# Altium schematic sheet PWM_CONTROL.SchDoc: PWM Control
size 279 x 215 mm; DrawnBy: Ethan Abraham; Engineer: Ethan Abraham; Revision: 1.0; SheetNumber: 7; SheetTotal: 7
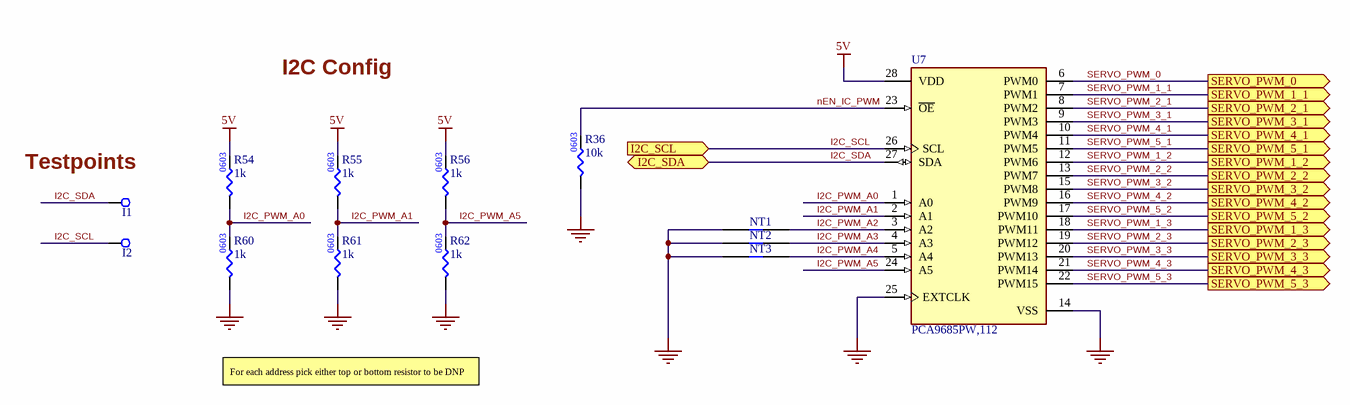
[diagram p0: PWM_CONTROL.SchDoc]

## Parts
I1  RCWCTE  [RCWCTE]  (value not drawn)
I2  RCWCTE  [RCWCTE]  (value not drawn)
NT1  .NET_TIE  [.NET_TIE]  (value not drawn)
NT2  .NET_TIE  [.NET_TIE]  (value not drawn)
NT3  .NET_TIE  [.NET_TIE]  (value not drawn)
R36  Resistance: 10k  [.RES_0603]  (hidden comment: RC0603FR-0710KL)
R54  Resistance: 1k  [.RES_0603]  (hidden comment: RC0603FR-071KL)
R55  Resistance: 1k  [.RES_0603]  (hidden comment: RC0603FR-071KL)
R56  Resistance: 1k  [.RES_0603]  (hidden comment: RC0603FR-071KL)
R60  Resistance: 1k  [.RES_0603]  (hidden comment: RC0603FR-071KL)
R61  Resistance: 1k  [.RES_0603]  (hidden comment: RC0603FR-071KL)
R62  Resistance: 1k  [.RES_0603]  (hidden comment: RC0603FR-071KL)
U7  PCA9685PW,112  [PCA9685PW,112]

## Ports
I2C_SCL (in), I2C_SDA (bidir), SERVO_PWM_0 (out), SERVO_PWM_1_1 (out), SERVO_PWM_1_2 (out), SERVO_PWM_1_3 (out), SERVO_PWM_2_1 (out), SERVO_PWM_2_2 (out), SERVO_PWM_2_3 (out), SERVO_PWM_3_1 (out), SERVO_PWM_3_2 (out), SERVO_PWM_3_3 (out), SERVO_PWM_4_1 (out), SERVO_PWM_4_2 (out), SERVO_PWM_4_3 (out), SERVO_PWM_5_1 (out), SERVO_PWM_5_2 (out), SERVO_PWM_5_3 (out)

## Nets
5V: R54.2 R55.2 R56.2 U7.28(VDD)
GND: NT1.1 NT2.1 NT3.1 R36.1 R60.1 R61.1 R62.1 U7.14(VSS) U7.25(EXTCLK)
I2C_PWM_A0: R54.1 R60.2 U7.1(A0)
I2C_PWM_A1: R55.1 R61.2 U7.2(A1)
I2C_PWM_A2: NT1.2 U7.3(A2)
I2C_PWM_A3: NT2.2 U7.4(A3)
I2C_PWM_A4: NT3.2 U7.5(A4)
I2C_PWM_A5: R56.1 R62.2 U7.24(A5)
I2C_SCL: I2.1 U7.26(SCL) ; port I2C_SCL
I2C_SDA: I1.1 U7.27(SDA) ; port I2C_SDA
nEN_IC_PWM: R36.2 U7.23(~{OE})
SERVO_PWM_0: U7.6(PWM0) ; port SERVO_PWM_0
SERVO_PWM_1_1: U7.7(PWM1) ; port SERVO_PWM_1_1
SERVO_PWM_1_2: U7.12(PWM6) ; port SERVO_PWM_1_2
SERVO_PWM_1_3: U7.18(PWM11) ; port SERVO_PWM_1_3
SERVO_PWM_2_1: U7.8(PWM2) ; port SERVO_PWM_2_1
SERVO_PWM_2_2: U7.13(PWM7) ; port SERVO_PWM_2_2
SERVO_PWM_2_3: U7.19(PWM12) ; port SERVO_PWM_2_3
SERVO_PWM_3_1: U7.9(PWM3) ; port SERVO_PWM_3_1
SERVO_PWM_3_2: U7.15(PWM8) ; port SERVO_PWM_3_2
SERVO_PWM_3_3: U7.20(PWM13) ; port SERVO_PWM_3_3
SERVO_PWM_4_1: U7.10(PWM4) ; port SERVO_PWM_4_1
SERVO_PWM_4_2: U7.16(PWM9) ; port SERVO_PWM_4_2
SERVO_PWM_4_3: U7.21(PWM14) ; port SERVO_PWM_4_3
SERVO_PWM_5_1: U7.11(PWM5) ; port SERVO_PWM_5_1
SERVO_PWM_5_2: U7.17(PWM10) ; port SERVO_PWM_5_2
SERVO_PWM_5_3: U7.22(PWM15) ; port SERVO_PWM_5_3

## Notes on the sheet
- I2C Config
- (near I1) Testpoints
- For each address pick either top or bottom resistor to be DNP
- PuttPilot
- 200 University Ave W
- PROJECT
- Waterloo, Ontario, Canada
- N2L 3G1
- REVISION
- DOCUMENT
- ENGINEER
- REVIEWER
- MODIFIED
- SHEET
- OF

## Library data of the parts
I1 I2 = RCWCTE: SMT Test Point; Manufacturer: KOA Speer; Resistance: 0R; Current Rating: 2A; Number of Contacts: 1; Supplier 1: Digikey; Manufacturer Part Number: RCWCTE; RoHS: Yes; Category: Chip SMD Resistors; Stock 1: 56953; Pricing 1: 1=0.2, 10=0.15, 25=0.1344, 50=0.1238, 100=0.1141, 250=0.10268, 500=0.09488, 1000=0.08781 (USD); Mount: Surface Mount; Case/Package: 1206; Case Code (Imperial): 1206; Case Code (Metric): 3216; Contact Material: Copper,Tin; Min Operating Temperature: -55°C; Max Operating Temperature: 125°C; Packaging: Tape and Reel; Termination: SMD/SMT; Series: RC; Length: 3.2mm; Width: 1.6mm; Height: 2mm; Depth: 1.6mm; Military Standard: Not; RoHS Compliant: Yes; ComponentLink1URL: https://datasheet.ciiva.com/34302/1876186-34302940.pdf?src-supplier=Jameco; ComponentLink1Description: https://datasheet.ciiva.com/34302/1876186-34302940.pdf?src-supplier=Jameco; ComponentLink2URL: https://datasheet.ciiva.com/5556/rc-5556236.pdf?src-supplier=Mouser; ComponentLink2Description: https://datasheet.ciiva.com/5556/rc-5556236.pdf?src-supplier=Mouser; ComponentLink3URL: https://datasheet.ciiva.com/26821/getdatasheetpartid-110197-26821157.pdf?src-supplier=Verical; ComponentLink3Description: https://datasheet.ciiva.com/26821/getdatasheetpartid-110197-26821157.pdf?src-supplier=Verical; Supplier Part Number 1: 2019-RCWCTECT-ND
NT1-NT3 = .NET_TIE: .GENERIC NET TIE
R36 = RC0603FR-0710KL: RES 10K OHM 0603; Manufacturer: Yageo; Tolerance: 1%; Additional Feature: LASER TRIMMABLE; Rated Power Dissipation (P): 100mW; Rated Temperature: 70°C; Temperature Coefficient: 100ppm/°C; Working Voltage: 75V; Package Height: 0.45mm; Package Length: 1.6mm; Package Width: 0.8mm; Supplier 1: Future Electronics; Manufacturer Part Number: RC0603FR-0710KL; RoHS: Yes; Category: Chip SMD Resistors; Stock 1: 30355000; Pricing 1: 5000=0.0026, 50000=0.0025, 150000=0.0024, 375000=0.0023, 1000000=0.0022 (USD); Mount: Surface Mount; Number of Pins: 2; Package Shape: Rectangular; Size Code: 0603; Terminal Finish: Nickel; Min Operating Temperature: -55°C; Max Operating Temperature: 155°C; JESD-609 Code: e3; Resistor Type: FIXED RESISTOR; Construction: Chip; Package Style: SMTMeter; Packaging: Tape and Reel; Technology: METAL GLAZE/THICK FILM; Termination: Wraparound; Reach SVHC Compliant: Yes; RoHS Compliant: Yes; ComponentLink1URL: https://datasheet.ciiva.com:443/pdfs/VipMasterIC/IC/YAGO/YAGO-S-A0008145938/YAGO-S-A0008145938-1.pdf?src-supplier=IHS+Markit; ComponentLink1Description: https://datasheet.ciiva.com:443/pdfs/VipMasterIC/IC/YAGO/YAGO-S-A0008145938/YAGO-S-A0008145938-1.pdf?src-supplier=IHS+Markit; ComponentLink2URL: https://datasheet.ciiva.com/22747/443971-22747519.pdf?src-supplier=Element14; ComponentLink2Description: https://datasheet.ciiva.com/22747/443971-22747519.pdf?src-supplier=Element14; ComponentLink3URL: https://datasheet.ciiva.com/46440/1868787-46440891.pdf?src-supplier=Element14; ComponentLink3Description: https://datasheet.ciiva.com/46440/1868787-46440891.pdf?src-supplier=Element14; ComponentLink4URL: https://datasheet.ciiva.com/15189/getdatasheetpartid-409289-15189591.pdf?src-supplier=Verical; ComponentLink4Description: https://datasheet.ciiva.com/15189/getdatasheetpartid-409289-15189591.pdf?src-supplier=Verical; ComponentLink5URL: https://datasheet.ciiva.com/7660/38590-7660789.pdf?src-supplier=Element14; ComponentLink5Description: https://datasheet.ciiva.com/7660/38590-7660789.pdf?src-supplier=Element14; ComponentLink6URL: https://datasheet.ciiva.com/7746/1738695-7746239.pdf?src-supplier=Element14; ComponentLink6Description: https://datasheet.ciiva.com/7746/1738695-7746239.pdf?src-supplier=Element14; ComponentLink7URL: https://datasheet.ciiva.com/7983/443971-7983596.pdf?src-supplier=Element14; ComponentLink7Description: https://datasheet.ciiva.com/7983/443971-7983596.pdf?src-supplier=Element14; Supplier Part Number 1: 4023214
R54-R56 R60-R62 = RC0603FR-071KL: RES 1K OHM 0603; Manufacturer: Yageo; Tolerance: 1%; Additional Feature: LASER TRIMMABLE; Rated Power Dissipation (P): 100mW; Rated Temperature: 70°C; Temperature Coefficient: 100ppm/°C; Working Voltage: 75V; Package Height: 0.45mm; Package Length: 1.6mm; Package Width: 0.8mm; Supplier 1: Future Electronics; Manufacturer Part Number: RC0603FR-071KL; RoHS: Yes; Category: Chip SMD Resistors; Stock 1: 12810000; Pricing 1: 5000=0.0026, 50000=0.0025, 150000=0.0024, 375000=0.0023, 1000000=0.0022 (USD); Mount: Surface Mount; Number of Pins: 2; Package Shape: Rectangular; Size Code: 0603; Terminal Finish: Nickel; Min Operating Temperature: -55°C; Max Operating Temperature: 155°C; JESD-609 Code: e3; Resistor Type: FIXED RESISTOR; Construction: Chip; Package Style: SMTMeter; Packaging: Tape and Reel; Technology: METAL GLAZE/THICK FILM; Termination: Wraparound; Reach SVHC Compliant: Yes; RoHS Compliant: Yes; ComponentLink1URL: https://datasheet.ciiva.com:443/pdfs/VipMasterIC/IC/YAGO/YAGO-S-A0008145938/YAGO-S-A0008145938-1.pdf?src-supplier=IHS+Markit; ComponentLink1Description: https://datasheet.ciiva.com:443/pdfs/VipMasterIC/IC/YAGO/YAGO-S-A0008145938/YAGO-S-A0008145938-1.pdf?src-supplier=IHS+Markit; ComponentLink2URL: https://datasheet.ciiva.com/11808/0900766b80f96399-11808081.pdf?src-supplier=Rs; ComponentLink2Description: https://datasheet.ciiva.com/11808/0900766b80f96399-11808081.pdf?src-supplier=Rs; ComponentLink3URL: https://datasheet.ciiva.com/8896/pyu-rc0603-51-rohs-l-4-8896106.pdf?src-supplier=Avnet; ComponentLink3Description: https://datasheet.ciiva.com/8896/pyu-rc0603-51-rohs-l-4-8896106.pdf?src-supplier=Avnet; ComponentLink4URL: https://datasheet.ciiva.com/7660/1868787-7660790.pdf?src-supplier=Element14; ComponentLink4Description: https://datasheet.ciiva.com/7660/1868787-7660790.pdf?src-supplier=Element14; ComponentLink5URL: https://datasheet.ciiva.com/7746/1738695-7746279.pdf?src-supplier=Element14; ComponentLink5Description: https://datasheet.ciiva.com/7746/1738695-7746279.pdf?src-supplier=Element14; ComponentLink6URL: https://datasheet.ciiva.com/7746/1686128-7746280.pdf?src-supplier=Element14; ComponentLink6Description: https://datasheet.ciiva.com/7746/1686128-7746280.pdf?src-supplier=Element14; ComponentLink7URL: https://datasheet.ciiva.com/7746/1738695-7746281.pdf?src-supplier=Element14; ComponentLink7Description: https://datasheet.ciiva.com/7746/1738695-7746281.pdf?src-supplier=Element14; ComponentLink8URL: https://datasheet.ciiva.com/7983/443971-7983613.pdf?src-supplier=Element14; ComponentLink8Description: https://datasheet.ciiva.com/7983/443971-7983613.pdf?src-supplier=Element14; ComponentLink9URL: https://datasheet.ciiva.com/15189/getdatasheetpartid-404327-15189644.pdf?src-supplier=Verical; ComponentLink9Description: https://datasheet.ciiva.com/15189/getdatasheetpartid-404327-15189644.pdf?src-supplier=Verical; Supplier Part Number 1: 4016291
U7 = PCA9685PW,112: I2C LED Driver; Manufacturer: NXP Semiconductors; Package Body Material: Plastic; Data Input Mode: SERIAL; fmax-Min: 1MHz; Interface IC Type: LED DISPLAY DRIVER; Multiplexed Display Capability: No; Number of Functions: 1; Number of Segments: 16; Package Equivalence Code: TSSOP28,.25; Power Supplies: 2.5/5V; Max Supply Voltage: 5.5V; Min Supply Voltage: 2.3V; Supply Voltage-Nom: 3V; Time @ Peak Reflow Temperature-Max (s): 30s; Qualification Status: Not Qualified; Supplier 1: Newark; Manufacturer Part Number: PCA9685PW,112; RoHS: Yes; Category: LED Drivers; Stock 1: 13575; Pricing 1: 1=1.3, 10=1.3, 25=1.3, 50=1.3, 100=1.3, 250=1.29, 500=1.27 (USD); Package Code: TSSOP; Number of Pins: 28; Package Shape: Rectangular; Terminal Finish: Gold; Min Operating Temperature: -40°C; Max Operating Temperature: 85°C; JESD-609 Code: e4; JESD-30 Code: R-PDSO-G28; Moisture Sensitivity Level: 1; Package Style: SMALL OUTLINE, THIN PROFILE, SHRINK PITCHMeter; Peak Reflow Temperature (Cel): 260°C; Surface Mount: Yes; Terminal Form: Gull Wing; Terminal Position: DUAL; Length: 9.7mm; Width: 4.4mm; Height - Seated (Max): 1.1mm; Terminal Pitch: 0.65mm; Temperature Grade: INDUSTRIAL; Reach SVHC Compliant: Yes; RoHS Compliant: Yes; ComponentLink1URL: https://datasheet.ciiva.com:443/pdfs/VipMasterIC/IC/PHGL/PHGL-S-A0000775254/PHGL-S-A0000775254-1.pdf?src-supplier=IHS+Markit; ComponentLink1Description: https://datasheet.ciiva.com:443/pdfs/VipMasterIC/IC/PHGL/PHGL-S-A0000775254/PHGL-S-A0000775254-1.pdf?src-supplier=IHS+Markit; ComponentLink2URL: https://datasheet.ciiva.com/1945/pca9685-1945096.pdf?src-supplier=Digikey; ComponentLink2Description: https://datasheet.ciiva.com/1945/pca9685-1945096.pdf?src-supplier=Digikey; ComponentLink3URL: https://datasheet.ciiva.com/8125/pca9685-8125354.pdf?src-supplier=Avnet; ComponentLink3Description: https://datasheet.ciiva.com/8125/pca9685-8125354.pdf?src-supplier=Avnet; Supplier Part Number 1: 85AC2130